# EAGLE design ArduOSD_Simple (EAGLE 6.2)
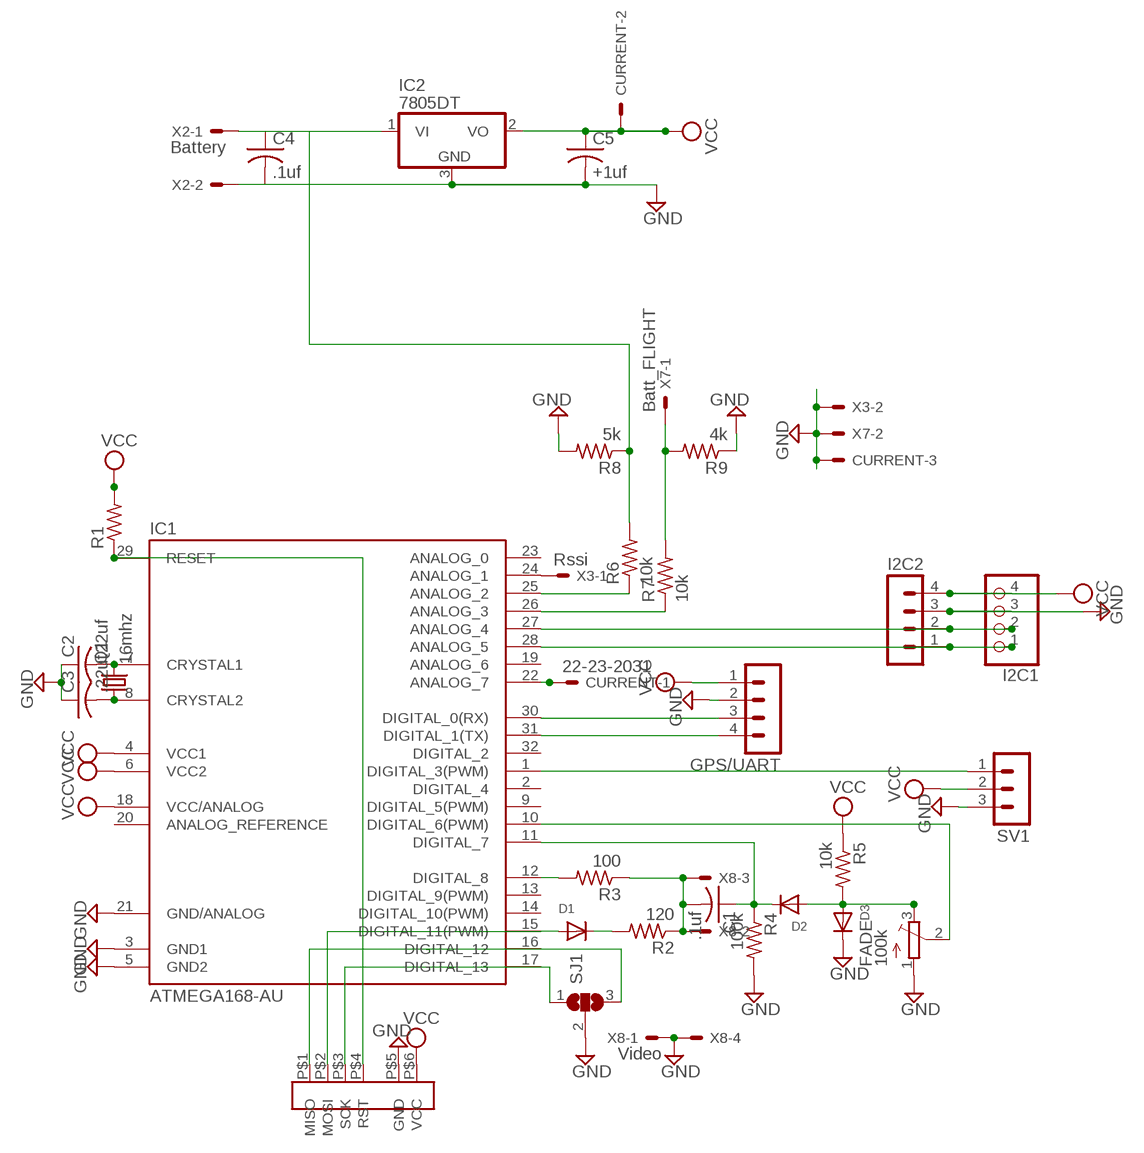
[diagram p0: schematic, sheet 1]

## Parts
C1  .1uf  C-USC0805K  [C0805K]
C2  .22uf  C-USC0805K  [C0805K]
C3  .22uf  C-USC0805K  [C0805K]
C4  .1uf  C-USC0805K  [C0805K]
C5  +1uf  C-USC0805K  [C0805K]
CURRENT  22-23-2031  [22-23-2031]
D1  DIODESOT23_WAVE  [SOT23-W]
D2  DIODESOT23_WAVE  [SOT23-W]
D3  DIODESOT23_WAVE  [SOT23-W]
FADE  100k  TRIMPOTTC33X  [TC33X]
GPS/UART  MA04-1  [MA04-1]
I2C1  PINHD-1X4  [1X04]
I2C2  MA04-1  [MA04-1]
IC1  ATMEGA168-AU  [TQFP32-08]
IC2  7805DT  [TO252]
Q1  16mhz  CSM-7X-DU  [CSM-7X-DU]
R1  R-US_R0805  [R0805]
R2  120  R-US_R0805  [R0805]
R3  100  R-US_R0805  [R0805]
R4  100k  R-US_R0805  [R0805]
R5  10k  R-US_R0805  [R0805]
R6  10k  R-US_R0805  [R0805]
R7  10k  R-US_R0805  [R0805]
R8  5k  R-US_R0805  [R0805]
R9  4k  R-US_R0805  [R0805]
SJ1  SJ2W  [SJ_2]
SV1  MA03-1  [MA03-1]
U$1  LIN_ISP  [LINEAR_ISP]
X2  Battery  22-23-2021  [22-23-2021]
X3  Rssi  22-23-2021  [22-23-2021]
X7  Batt_FLIGHT  22-23-2021  [22-23-2021]
X8  Video  22-23-2041  [22-23-2041]

## Nets
BATT_FPV: C4.1 IC2.1(VI) R6.2 R8.1 X2.1
GND: C2.1 C3.1 C4.2 C5.2 CURRENT.3 D3.3(C) FADE.1(A) GPS/UART.2 I2C1.3 I2C2.3 IC1.3(GND1) IC1.5(GND2) IC1.21(GND/ANALOG) IC2.3(GND) R4.2 R8.2 R9.1 SJ1.2 SV1.3 U$1.P$5(GND) X2.2 X3.2 X7.2 X8.1 X8.4
GPS_DAT: GPS/UART.3 IC1.30(DIGITAL_0(RX))
N$1: IC1.29(RESET) R1.1 U$1.P$4(RST)
N$2: D1.1(A) IC1.15(DIGITAL_11(PWM)) U$1.P$2(MOSI)
N$3: D1.3(C) R2.2
N$4: IC1.12(DIGITAL_8) R3.2
N$5: C1.2 R2.1 R3.1 X8.2 X8.3
N$6: C1.1 D2.3(C) IC1.11(DIGITAL_7) R4.1
N$7: D2.1(A) D3.1(A) FADE.3(E) R5.2
N$8: FADE.2(S) IC1.10(DIGITAL_6(PWM))
N$9: GPS/UART.4 IC1.31(DIGITAL_1(TX))
N$10: IC1.26(ANALOG_3) R7.1
N$11: C2.2 IC1.7(CRYSTAL1) Q1.2
N$12: C3.2 IC1.8(CRYSTAL2) Q1.1
N$13: IC1.25(ANALOG_2) R6.1
N$14: IC1.24(ANALOG_1) X3.1
N$15: IC1.16(DIGITAL_12) SJ1.3 U$1.P$1(MISO)
N$16: IC1.17(DIGITAL_13) SJ1.1 U$1.P$3(SCK)
N$17: CURRENT.1 IC1.22(ANALOG_7)
N$18: IC1.1(DIGITAL_3(PWM)) SV1.1
N$19: R7.2 R9.2 X7.1
SCL: I2C1.1 I2C2.1 IC1.28(ANALOG_5)
SDA: I2C1.2 I2C2.2 IC1.27(ANALOG_4)
VCC: C5.1 CURRENT.2 GPS/UART.1 I2C1.4 I2C2.4 IC1.4(VCC1) IC1.6(VCC2) IC1.18(VCC/ANALOG) IC2.2(VO) R1.2 R5.1 SV1.2 U$1.P$6(VCC)
Unconnected: IC1.2(DIGITAL_4) IC1.9(DIGITAL_5(PWM)) IC1.13(DIGITAL_9(PWM)) IC1.14(DIGITAL_10(PWM)) IC1.19(ANALOG_6) IC1.20(ANALOG_REFERENCE) IC1.23(ANALOG_0) IC1.32(DIGITAL_2)

## Library data of the parts
C1-C5 = adafruit:C-US: CAPACITOR, American symbol
CURRENT = con-molex:22-23-2031: .100" (2.54mm) Center Header - 3 Pin; MF: MOLEX; MPN: 22-23-2031; OC_FARNELL: 1462950; OC_NEWARK: 30C0862
D1-D3 = adafruit:DIODE: Diode SMADIODE - SMA Surface Mount Package 20V 1A Schottky Diode Digikey: 641-1014-6-ND DO-1N4148 - Through Hole Small Current Diode SOD-123 20V 1 A (.5mV Vf) Schottky Diode - Digikey: MBRX120TPMSCT-ND SOD-323 10V 570mA (.38mV Vf, 3ns) Schottky Diode - Digikey: ZLLS410CT-ND SOD-523 30V 30mA Schottky Diode (RB751S-40TE61) - Digikey: RB751S-40TE61CT-ND SOT23-R/W - SOT23 Package (R = Solder Paste/Reflow Ovens, W = Hand-Soldering) BAT54Film 40V 300mA - Digikey: 497-7162-1-ND
FADE = adafruit:TRIMPOT: SMT trimmer potentiometer part number TC33X http://www.ladyada.net/library/eagle
GPS/UART I2C2 = con-lstb:MA04-1: PIN HEADER; OC_FARNELL: unknown; OC_NEWARK: unknown
I2C1 = pinhead:PINHD-1X4: PIN HEADER
IC1 = Arduino-AVR:ATMEGA168
IC2 = adafruit:78*: Positive VOLTAGE REGULATOR Added bigger pads to the TO-92 package
Q1 = crystal:CSM-7X-DU: SMD CRYSTAL Source: www.ecsxtal.com .. Crystal 3.6864MHz CSM_7X_DU.PDF; OC_FARNELL: unknown; OC_NEWARK: unknown
R1-R9 = adafruit:R-US_: RESISTOR, American symbol
SJ1 = jumper:SJ2W: SMD solder JUMPER
SV1 = con-lstb:MA03-1: PIN HEADER; OC_FARNELL: unknown; OC_NEWARK: unknown
U$1 = Legot:LIN_ISP: ISP or ICSP for AVR chips. 6 pin 1: Mosi 2: Miso 3: SCK 4: RST 5: GND 6: VCC
X2 X3 X7 = con-molex:22-23-2021: .100" (2.54mm) Center Header - 2 Pin; MF: MOLEX; MPN: 22-23-2021; OC_FARNELL: 1462926; OC_NEWARK: 25C3832
X8 = con-molex:22-23-2041: .100" (2.54mm) Center Header - 4 Pin; MF: MOLEX; MPN: 22-23-2041; OC_FARNELL: 1462920; OC_NEWARK: 38C0355

## Board
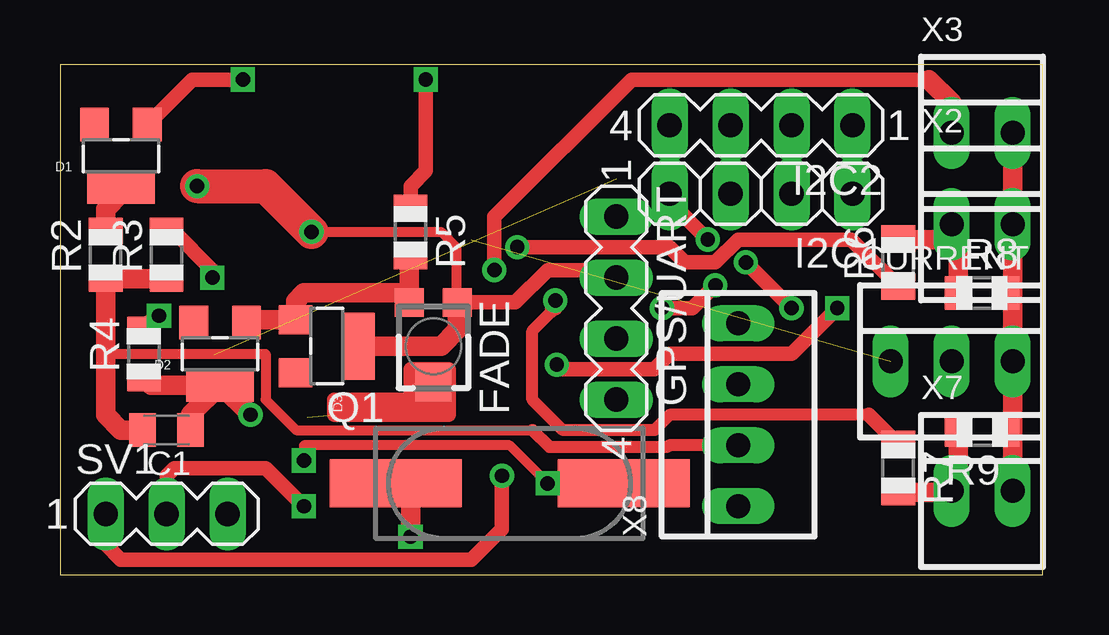
[diagram p1: board, top side]
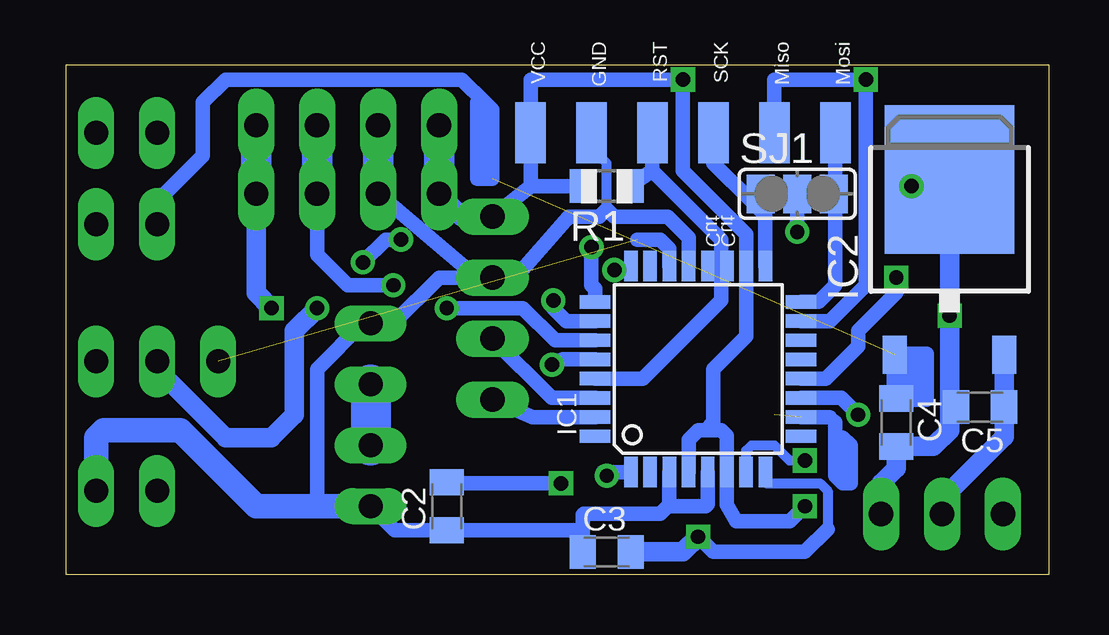
[diagram p2: board, bottom side, seen from below]

Size 40.95 x 21.26 mm. Coordinates in mm from the lower left corner, seen from the top.
Outline: 0,0 40.95,0 40.95,21.26 0,21.26 0,0
Copper layers (1*16): Top 0.035mm / dielectric 1.5mm / Bottom 0.035mm
Design rules: minimum track width 10mil, minimum drill 24mil, track to track 8mil, track to pad 8mil, pad to pad 8mil, via to via 8mil, smd to smd 8mil, copper to edge 40mil, drill to drill 8mil, minimum pad ring 10mil, minimum via ring 8mil, stop-mask expansion 4mil, vias tented up to drill 0mil, thermal gap 10mil

### Footprints (pad centres in the part's own frame; a part is rotated, then mirrored left to right if it is on the bottom)
C0805K = smd 1.1 x 1.4: 1 -1,0; 2 1,0
22-23-2031 = drill 1 long: 1 -2.54,0; 2 0,0; 3 2.54,0
SOT23-W = smd 1.2 x 1.4: 1 -1.1,-1.3; 2 1.1,-1.3 | smd 2.8 x 1.4: 3 0,1.3
TC33X = smd 1.2 x 1.2: 1 -1,-1.825; 3 1,-1.825 | smd 1.5 x 1.6: 2 0,1.5
MA04-1 = drill 1.016 long: 1 -3.81,0; 2 -1.27,0; 3 1.27,0; 4 3.81,0
1X04 = drill 1.016 long: 1 -3.81,0; 2 -1.27,0; 3 1.27,0; 4 3.81,0
TQFP32-08 = smd 1.27 x 0.559: 1 -4.293,2.8; 2 -4.293,2; 3 -4.293,1.2; 4 -4.293,0.4; 5 -4.293,-0.4; 6 -4.293,-1.2; 7 -4.293,-2; 8 -4.293,-2.8; 17 4.293,-2.8; 18 4.293,-2; 19 4.293,-1.2; 20 4.293,-0.4; 21 4.293,0.4; 22 4.293,1.2; 23 4.293,2; 24 4.293,2.8 | smd 0.559 x 1.27: 9 -2.8,-4.293; 10 -2,-4.293; 11 -1.2,-4.293; 12 -0.4,-4.293; 13 0.4,-4.293; 14 1.2,-4.293; 15 2,-4.293; 16 2.8,-4.293; 25 2.8,4.293; 26 2,4.293; 27 1.2,4.293; 28 0.4,4.293; 29 -0.4,4.293; 30 -1.2,4.293; 31 -2,4.293; 32 -2.8,4.293
TO252 = smd 1 x 1.6: 1 -2.28,-4.8; 2 2.28,-4.8 | smd 5.4 x 6.2: 3 0,2.5
CSM-7X-DU = smd 5.5 x 2: 1 -4.75,0; 2 4.75,0
R0805 = smd 1.1 x 1.4: 1 -1,0; 2 1,0
SJ_2 = smd 1.168 x 1.6: 1 -1.524,0; 2 0,0; 3 1.524,0
MA03-1 = drill 1.016 long: 1 -2.54,0; 2 0,0; 3 2.54,0
LINEAR_ISP = smd 1.27 x 2.54: P$1 -6.35,0; P$2 -3.81,0; P$3 -1.27,0; P$4 1.27,0; P$5 3.81,0; P$6 6.35,0
22-23-2021 = drill 1 long: 1 -1.27,0; 2 1.27,0
22-23-2041 = drill 1 long: 1 -3.81,0; 2 -1.27,0; 3 1.27,0; 4 3.81,0

### Placement (x,y rotation side)
C1  4.45,6.03 180 top
C2  25.08,2.86 90 bottom
C3  18.41,0.95 0 bottom
C4  6.35,6.35 270 bottom
C5  2.86,6.98 180 bottom
CURRENT  37.15,8.89 0 top
D1  2.54,17.46 180 top
D2  6.67,9.21 180 top
D3  11.11,9.52 270 top
FADE  15.56,9.52 180 top
GPS/UART  23.18,11.11 270 top
I2C1  29.21,15.88 180 top
I2C2  29.21,18.73 180 top
IC1  14.61,8.57 90 bottom
IC2  4.13,13.97 0 bottom
Q1  18.73,3.81 0 top
R1  18.41,16.19 180 bottom
R2  1.91,13.33 90 top
R3  4.45,13.33 90 top
R4  3.49,9.21 90 top
R5  14.61,14.29 270 top
R6  34.92,13.02 90 top
R7  34.92,4.45 270 top
R8  38.42,11.75 0 top
R9  38.42,6.03 180 top
SJ1  10.48,15.88 0 bottom
SV1  4.45,2.54 0 top
U$1  15.24,18.41 180 bottom
X2  38.42,14.61 0 top
X3  38.42,18.41 0 top
X7  38.42,3.49 0 top
X8  28.26,6.67 90 top

### Tracks (layer width: path | path; a pad name or v marks a point on that pad's centre or on a via)
BATT_FPV  (via drill 0.6)  (1 unrouted)
  Top 0.406: R6.2 36.88,14.02 37.15,14.29 X2.1
  Top 0.813: X2.1 37.42,14.02 37.42,13.97 | 37.42,13.97 R8.1 | R6.2 34.97,13.97 37.42,13.97
  Bottom 0.61: 37.15,15.56 35.24,17.46 35.24,19.69 34.29,20.64 24.45,20.64 23.5,19.69 | IC2.1 6.37,9.21 5.08,9.21 5.08,7.3 5.71,7.3 5.71,8.89 5.4,8.57 5.4,7.62 | 23.5,19.69 23.81,19.69 23.81,16.51 23.5,16.51 | 23.5,19.69 23.18,19.37 23.18,16.51 23.5,16.51 | 23.5,19.69 23.5,16.83 23.5,16.51
  Bottom 0.813: IC2.1 6.35,9.17 C4.1 | X2.1 37.15,15.56
  other vias: 37.15,14.61
GND  (via drill 0.6)
  Top 0.406: v10.48,14.29 15.88,14.29 16.51,13.65 16.51,11.4 FADE.1
  Top 0.61: R9.1 39.42,5.99 39.69,5.72 | FADE.1 18.97,11.35 20.32,12.7 22.86,12.7 GPS/UART.2
  Top 0.813: R4.2 3.54,10.21 v4.13,10.8 | FADE.1 16.56,10.21 15.88,9.52 D3.3 | X7.2 39.69,5.4 39.69,5.72 | 39.69,5.72 39.69,5.76 R9.1 39.69,5.99 | X3.2 X2.2 39.69,11.7 R8.2 39.69,11.48 CURRENT.3 39.69,5.72
  Top 1.422: v5.71,16.19 8.57,16.19 v10.48,14.29
  Bottom 0.406: U$1.P$5 19.05,17.78 18.41,17.14 18.41,15.24
  Bottom 0.61: 23.81,12.38 GPS/UART.2 22.23,12.38 20,14.92 18.73,14.92 18.41,15.24 18.1,14.92 15.88,14.92 15.01,14.05 IC1.21 | 23.81,12.38 I2C1.3 | 23.81,12.38 25.4,12.38 27.3,10.48 X8.4 28.57,10.48 30.48,8.57 30.48,2.86 | 28.89,2.86 X8.1 27.26,1.86 C2.1 19.78,1.86 C3.1 19.41,2.49 19.37,2.54 16.19,2.54 15.8,2.93 | SJ1.2 v10.48,14.29 | IC1.3 15.8,2.93 | IC1.5 14.21,2.94 14.29,2.86 15.73,2.86 15.8,2.93
  Bottom 0.813: SV1.3 6.99,3.81 6.35,4.45 C4.2 4.81,5.35 4.13,6.03 4.13,7.25 | 4.13,7.25 v4.13,10.8 IC2.3 5.44,16.47 v5.71,16.19 | 4.13,7.25 C5.2
  Bottom 1.016: X7.2 39.69,5.72 39.37,6.03 36.2,6.03 33.02,2.86 30.48,2.86 X8.1
  Bottom 1.27: I2C2.3 I2C1.3
  other vias: 39.69,3.49
GPS_DAT
  Bottom 0.61: IC1.30 20.71,7.37 GPS/UART.3
N$1
  Bottom 0.61: U$1.P$4 16.51,16.83 | 16.51,16.83 13.65,13.97 13.65,11.43 16.91,8.17 IC1.29 | R1.1 17.41,16.24 16.51,16.83
N$2  (via drill 0.6)
  Top 0.61: D1.1 5.51,20.64 v7.62,20.64
  Bottom 0.61: IC1.15 9.11,10.57 7.62,12.07 v7.62,20.64 11.43,20.64 U$1.P$2
N$3
  Top 0.813: D1.3 2.54,15.88 1.91,15.24 R2.2
N$4  (via drill 0.6)
  Top 0.61: v6.35,12.38 6.35,12.7 4.71,14.33 R3.2
  Bottom 0.61: IC1.12 9.29,8.17 7.94,9.52 7.94,10.16 6.35,11.75 v6.35,12.38
N$5
  Top 0.406: 1.91,9.21 8.57,9.21 8.57,7.3 9.84,6.03 19.68,6.03
  Top 0.508: X8.2 25.38,5.4 25.3,5.32 20.4,5.32 19.68,6.03
  Top 0.61: R3.1 4.4,12.38 1.91,12.38 1.91,9.21
  Top 0.813: R3.1 R2.1 1.91,9.21 1.91,6.67 2.54,6.03 C1.2
  Bottom 1.676: X8.3 X8.2
N$6  (via drill 0.6)
  Top 0.813: D2.3 3.79,7.91 R4.1 | C1.1 5.45,6.69 D2.3 | D2.3 6.7,7.91 v7.94,6.67
  Bottom 0.61: v7.94,6.67 8.64,7.37 IC1.11
N$7
  Top 0.813: D2.1 7.88,10.63 D3.1 9.81,11.4 10.16,11.75 14.16,11.75 FADE.3 14.56,13.24 R5.2
N$8  (1 unrouted)
  Top 0.61: FADE.2 15.47,8.02 14.92,8.57 | 14.92,8.57 14.61,8.57 14.61,7.3 | 14.61,7.3 14.61,6.99 | 16.19,6.99 16.19,8.57 14.92,8.57 | 14.92,8.57 14.92,7.62 14.61,7.3 | 14.61,7.3 11.43,7.3 11.43,6.99 | 11.43,6.99 14.61,6.99 | 14.61,6.99 16.19,6.99 | 16.19,6.99 16.19,6.67 11.43,6.67 11.43,6.99
  Bottom 0.61: IC1.10 9.11,6.57 8.89,6.35 8.89,4.13 8.57,3.81 8.26,3.81 8.26,5.4 8.57,5.72 8.57,4.13
N$9
  Bottom 0.61: IC1.31 21.5,6.57 GPS/UART.4
N$10  (via drill 0.6)
  Top 0.508: 33.7,6.67 25.4,6.67 24.77,6.03 20.95,6.03 19.68,7.3 19.68,10.16 20.48,10.95 20.48,11.27 v20.64,11.43
  Top 0.61: v20.64,11.43 20.64,11.11 | 33.7,6.67 R7.1
  Bottom 0.61: IC1.26 20.1,10.57 20.64,11.11 v20.64,11.43
N$11  (via drill 0.6)
  Top 0.406: v20.32,3.81 18.73,5.4 10.16,5.4 v10.16,4.76
  Top 0.61: Q1.2 v20.32,3.81
  Bottom 0.406: IC1.7 12.61,5.17 12.38,5.4 11.43,5.4 10.79,4.76 v10.16,4.76
  Bottom 0.61: v20.32,3.81 25.04,3.81 C2.2
N$12  (via drill 0.6)
  Top 0.813: v14.61,1.59 14.61,3.19 Q1.1
  Bottom 0.406: IC1.8 11.8,3.87 11.75,3.81 9.53,3.81 9.21,3.49 9.21,1.91 9.53,1.59
  Bottom 0.61: v14.61,1.59 13.97,0.95 10.16,0.95 9.21,1.91
  Bottom 0.813: C3.2 15.24,0.95 v14.61,1.59
N$13  (via drill 0.6)
  Top 0.61: R6.1 32.97,13.97 28.26,13.97 27.3,13.02 26.04,13.02 25.4,13.65 v19.05,13.65
  Bottom 0.61: v19.05,13.65 19.05,12.07 18.9,11.91 IC1.25
N$14  (via drill 0.6)
  Top 0.61: 36.2,20.64 23.81,20.64 18.1,14.92 v18.1,12.7
  Top 0.813: X3.1 37.15,19.69 36.2,20.64
  Bottom 0.61: IC1.24 17.57,12.7 v18.1,12.7
N$15
  Bottom 0.61: U$1.P$1 8.89,16.51 | 8.89,16.51 8.89,12.07 9.58,11.37 IC1.16 | SJ1.3 8.95,16.45 8.89,16.51
N$16
  Bottom 0.61: IC1.17 11.8,14.98 12.38,15.56 | 12.38,15.56 13.97,17.14 U$1.P$3 | SJ1.1 12.06,15.88 12.38,15.56
N$17  (1 unrouted)
  Bottom 0.61: IC1.22 15.8,13.58 16.19,13.97 17.14,13.97
N$18  (via drill 0.6)
  Top 0.61: v18.41,4.13 18.41,1.91 17.14,0.64 2.54,0.64 1.91,1.27 SV1.1
  Bottom 0.61: IC1.1 18.58,4.28 v18.41,4.13
N$19
  Top 0.813: R7.2 37.1,3.45 X7.1 37.42,3.13 R9.2
SCL  (via drill 0.6)
  Top 0.61: v20.7,8.76 20.95,8.57 24.77,8.57 25.4,9.21 30.48,9.21 v32.38,11.11
  Bottom 0.61: IC1.28 20.24,8.97 v20.7,8.76
  Bottom 0.813: v32.38,11.11 33.02,11.75 I2C1.1
  Bottom 1.27: I2C2.1 I2C1.1
SDA  (via drill 0.6)
  Top 0.61: v25.08,11.11 26.35,11.11 v27.3,12.07
  Bottom 0.61: IC1.27 20.57,9.77 21.91,11.11 v25.08,11.11 | v27.3,12.07 29.21,12.07 30.48,13.33 I2C1.2
  Bottom 1.27: I2C2.2 I2C1.2
VCC  (via drill 0.6)
  Top 0.61: v10.16,2.86 8.57,4.45 4.76,4.45 4.45,4.13 SV1.2 | R5.1 14.61,16.19 15.24,16.83 v15.24,20.64 | v30.48,11.11 v28.57,13.02 | v26.99,13.97 25.4,15.56 I2C1.4
  Bottom 0.61: 14.29,6.03 13.65,6.03 13.4,5.78 IC1.6 13.4,2.93 13.02,2.22 10.79,2.22 v10.16,2.86 | 14.29,6.03 14.61,6.03 15.01,5.63 IC1.4 | 14.29,6.03 13.97,6.35 13.97,8.57 12.61,9.94 IC1.18 12.61,14.19 15.24,16.83 v15.24,20.64 21.59,20.64 U$1.P$6 21.59,16.19 | R1.2 21.59,16.19 | 21.59,16.19 GPS/UART.1 | v28.57,13.02 27.62,13.97 v26.99,13.97
  Bottom 0.813: IC2.2 1.85,6.68 C5.1 1.86,5.76 4.45,3.17 SV1.2 | GPS/UART.1 24.45,14.92 I2C1.4 | CURRENT.2 37.15,8.57 34.29,5.72 32.38,5.72 31.43,6.67 31.43,10.16 v30.48,11.11
  Bottom 1.27: I2C2.4 I2C1.4

### Text on the board
bPlace: Cut | Cut